# Altium schematic sheet PAGE6 - BANK2 I_0.SchDoc
size 386 x 246 mm
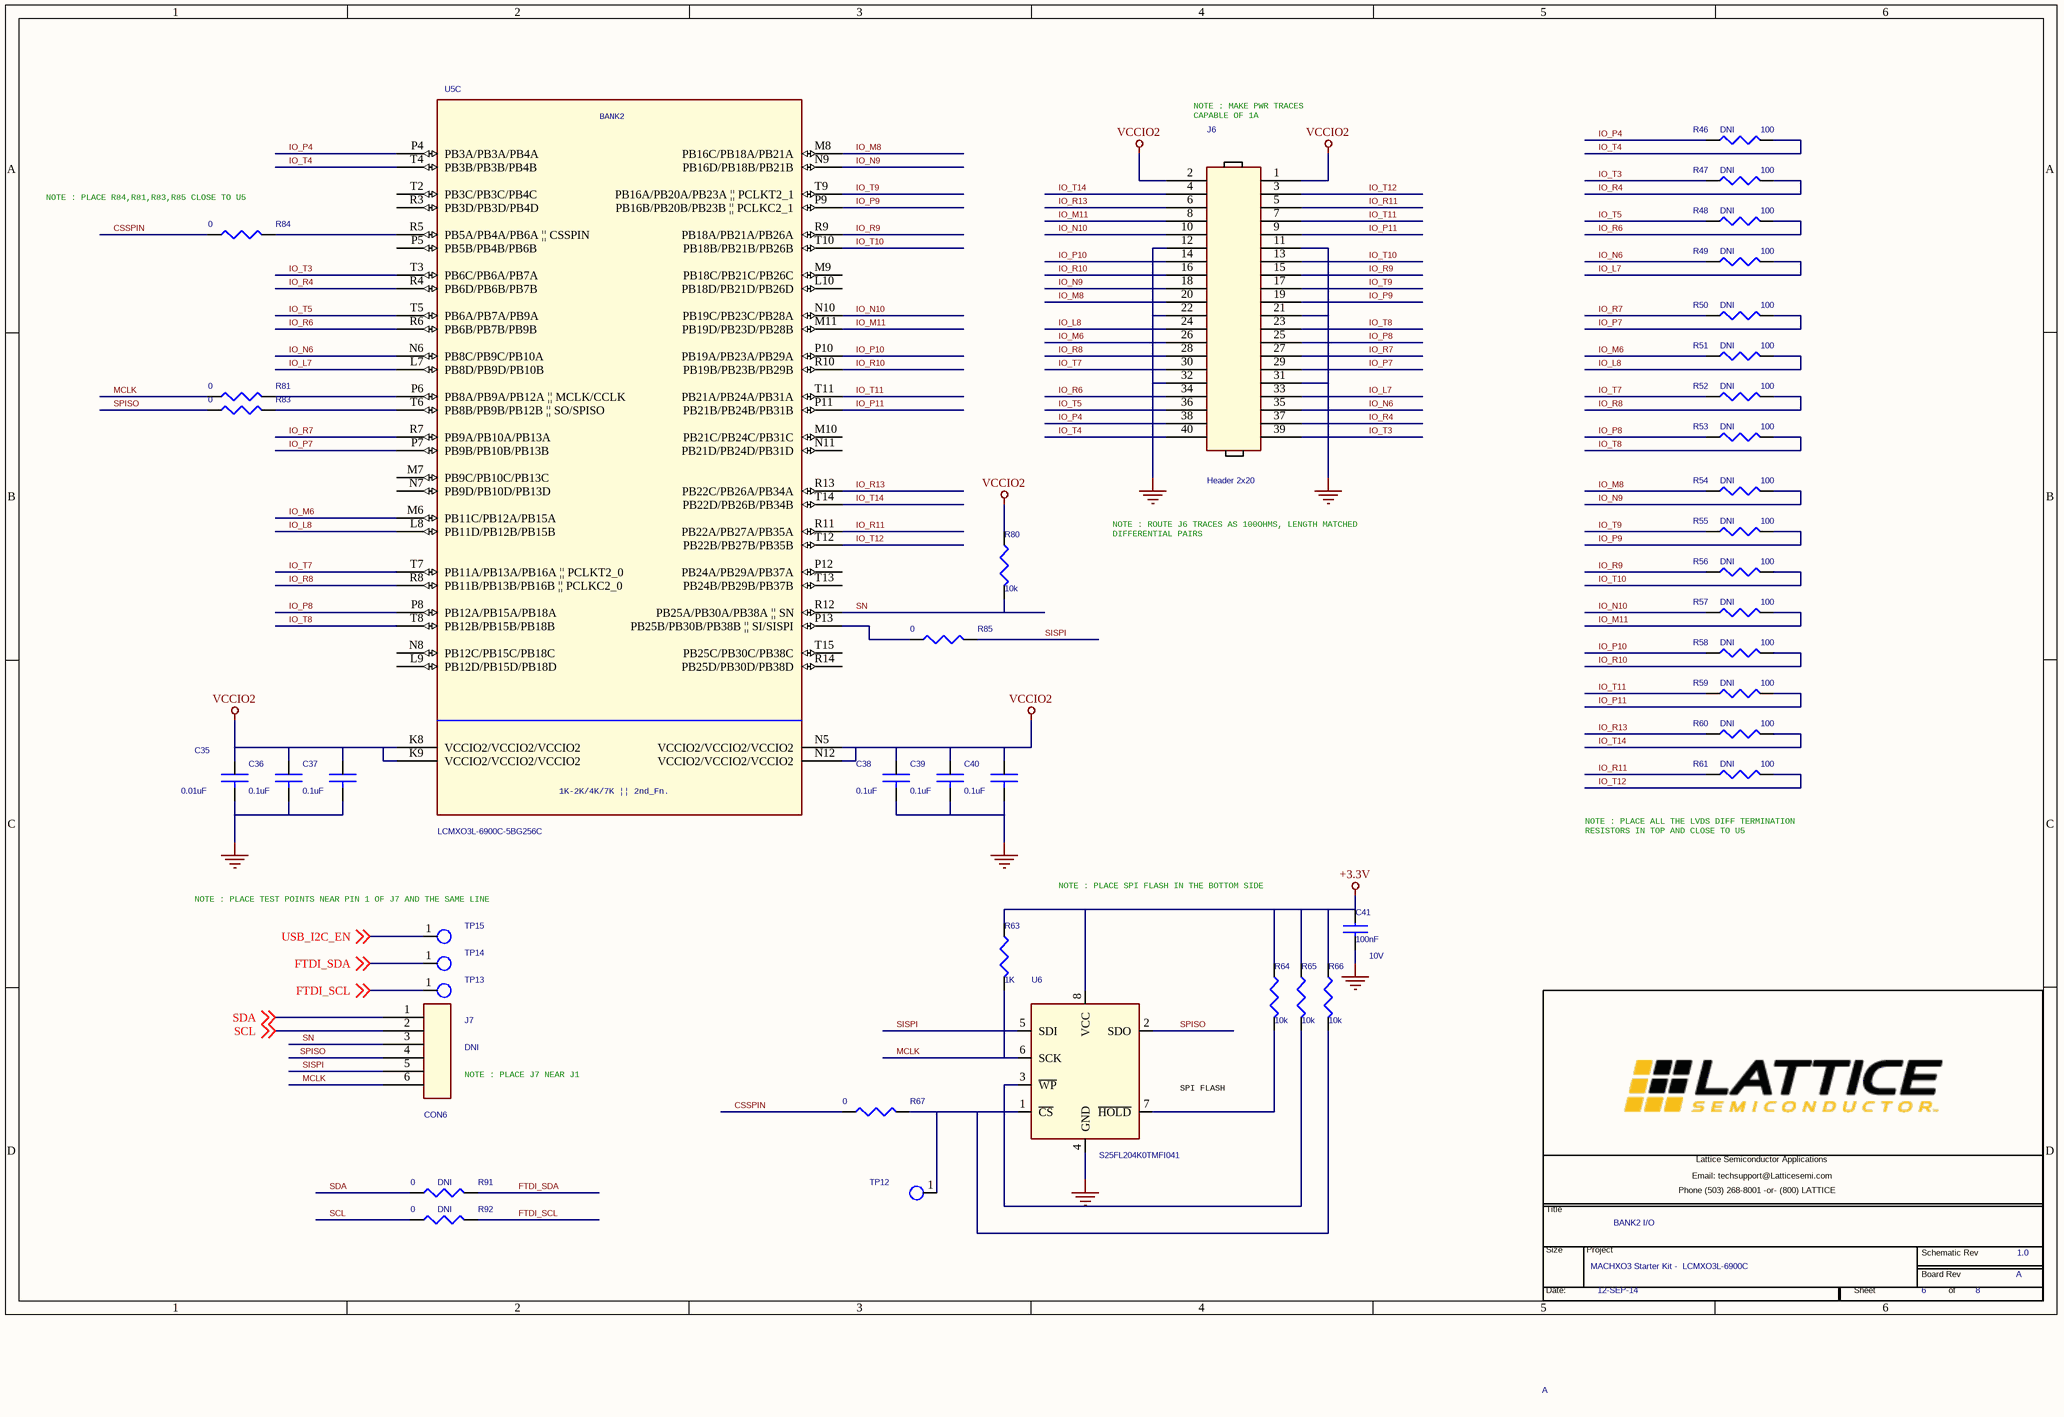
[diagram p0: PAGE6 - BANK2 I_0.SchDoc]

## Parts
*  Project Name: MACHXO3 Starter Kit -  LCMXO3L-6900C  Title: BANK2 I/O  Page Number: 6  Page Count: 8  RevCode: 1.0  Page Size: A  Date:: 12-SEP-14  (hidden comment: Lattice Title Block New Brand)  (graphical)
C35  0.01uF  [cc0402]
C36  0.1uF  [cc0402]
C37  0.1uF  [cc0402]
C38  0.1uF  [cc0402]
C39  0.1uF  [cc0402]
C40  0.1uF  [cc0402]
C41  100nF  Voltage: 10V  [C0402]
J6  Header 2x20  [hdr_samtec_mtsw_2x20_100]
J7  CON6  Assy: DNI  [hdr_samtec_tsw_1x6_100]
R46  100  Assy: DNI  [cr0603]
R47  100  Assy: DNI  [cr0603]
R48  100  Assy: DNI  [cr0603]
R49  100  Assy: DNI  [cr0603]
R50  100  Assy: DNI  [cr0603]
R51  100  Assy: DNI  [cr0603]
R52  100  Assy: DNI  [cr0603]
R53  100  Assy: DNI  [cr0603]
R54  100  Assy: DNI  [cr0603]
R55  100  Assy: DNI  [cr0603]
R56  100  Assy: DNI  [cr0603]
R57  100  Assy: DNI  [cr0603]
R58  100  Assy: DNI  [cr0603]
R59  100  Assy: DNI  [cr0603]
R60  100  Assy: DNI  [cr0603]
R61  100  Assy: DNI  [cr0603]
R63  1K  [R0402]
R64  10k  [R0402]
R65  10k  [R0402]
R66  10k  [R0402]
R67  0  [cr0603]
R80  10k  [R0402]
R81  0  [cr0603]
R83  0  [cr0603]
R84  0  [cr0603]
R85  0  [cr0603]
R91  0  Assy: DNI  [cr0603]
R92  0  Assy: DNI  [cr0603]
TP12  tp_s_40_63  [tp_s_40_63]  (value not drawn)
TP13  tp_s_40_63  [tp_s_40_63]  (value not drawn)
TP14  tp_s_40_63  [tp_s_40_63]  (value not drawn)
TP15  tp_s_40_63  [tp_s_40_63]  (value not drawn)
U5  LCMXO3L-6900C-5BG256C  [bga256_0p8_14p0]  (part C of 7)
U6  S25FL204K0TMFI041  [so8_50_244]

## Nets
+3.3V: C41.1 R63.1 R64.1 R65.1 R66.1 U6.8(VCC)
GND: C35.2 C36.2 C37.2 C38.2 C39.2 C40.2 C41.2 J6.11 J6.12 J6.21 J6.22 J6.31 J6.32 U6.4(GND)
VCCIO2: C35.1 C36.1 C37.1 C38.1 C39.1 C40.1 J6.1 J6.2 R80.1 U5.K8(VCCIO2/VCCIO2/VCCIO2) U5.K9(VCCIO2/VCCIO2/VCCIO2) U5.N5(VCCIO2/VCCIO2/VCCIO2) U5.N12(VCCIO2/VCCIO2/VCCIO2)
CSSPIN: R67.1 R84.1
FTDI_SCL: R92.2 TP13.1(TP) ; off-sheet FTDI_SCL
FTDI_SDA: R91.2 TP14.1(TP) ; off-sheet FTDI_SDA
IO_L7: J6.33 R49.2 U5.L7(PB8D/PB9D/PB10B)
IO_L8: J6.24 R51.2 U5.L8(PB11D/PB12B/PB15B)
IO_M6: J6.26 R51.1 U5.M6(PB11C/PB12A/PB15A)
IO_M8: J6.20 R54.1 U5.M8(PB16C/PB18A/PB21A)
IO_M11: J6.8 R57.2 U5.M11(PB19D/PB23D/PB28B)
IO_N6: J6.35 R49.1 U5.N6(PB8C/PB9C/PB10A)
IO_N9: J6.18 R54.2 U5.N9(PB16D/PB18B/PB21B)
IO_N10: J6.10 R57.1 U5.N10(PB19C/PB23C/PB28A)
IO_P4: J6.38 R46.1 U5.P4(PB3A/PB3A/PB4A)
IO_P7: J6.29 R50.2 U5.P7(PB9B/PB10B/PB13B)
IO_P8: J6.25 R53.1 U5.P8(PB12A/PB15A/PB18A)
IO_P9: J6.19 R55.2 U5.P9(PB16B/PB20B/PB23B_||_PCLKC2_1)
IO_P10: J6.14 R58.1 U5.P10(PB19A/PB23A/PB29A)
IO_P11: J6.9 R59.2 U5.P11(PB21B/PB24B/PB31B)
IO_R4: J6.37 R47.2 U5.R4(PB6D/PB6B/PB7B)
IO_R6: J6.34 R48.2 U5.R6(PB6B/PB7B/PB9B)
IO_R7: J6.27 R50.1 U5.R7(PB9A/PB10A/PB13A)
IO_R8: J6.28 R52.2 U5.R8(PB11B/PB13B/PB16B_||_PCLKC2_0)
IO_R9: J6.15 R56.1 U5.R9(PB18A/PB21A/PB26A)
IO_R10: J6.16 R58.2 U5.R10(PB19B/PB23B/PB29B)
IO_R11: J6.5 R61.1 U5.R11(PB22A/PB27A/PB35A)
IO_R13: J6.6 R60.1 U5.R13(PB22C/PB26A/PB34A)
IO_T3: J6.39 R47.1 U5.T3(PB6C/PB6A/PB7A)
IO_T4: J6.40 R46.2 U5.T4(PB3B/PB3B/PB4B)
IO_T5: J6.36 R48.1 U5.T5(PB6A/PB7A/PB9A)
IO_T7: J6.30 R52.1 U5.T7(PB11A/PB13A/PB16A_||_PCLKT2_0)
IO_T8: J6.23 R53.2 U5.T8(PB12B/PB15B/PB18B)
IO_T9: J6.17 R55.1 U5.T9(PB16A/PB20A/PB23A_||_PCLKT2_1)
IO_T10: J6.13 R56.2 U5.T10(PB18B/PB21B/PB26B)
IO_T11: J6.7 R59.1 U5.T11(PB21A/PB24A/PB31A)
IO_T12: J6.3 R61.2 U5.T12(PB22B/PB27B/PB35B)
IO_T14: J6.4 R60.2 U5.T14(PB22D/PB26B/PB34B)
MCLK: J7.6 R63.2 R81.1 U6.6(SCK)
SCL: J7.2 R92.1 ; off-sheet SCL
SDA: J7.1 R91.1 ; off-sheet SDA
SISPI: J7.5 R85.2 U6.5(SDI)
SN: J7.3 R80.2 U5.R12(PB25A/PB30A/PB38A_||_SN)
SPISO: J7.4 R83.1 U6.2(SDO)
USB_I2C_EN: TP15.1(TP) ; off-sheet USB_I2C_EN
NetR64_2: R64.2 U6.7(~{HOLD})
NetR65_2: R65.2 U6.3(~{WP})
NetR66_2: R66.2 R67.2 TP12.1(TP) U6.1(~{CS})
NetR81_2: R81.2 U5.P6(PB8A/PB9A/PB12A_||_MCLK/CCLK)
NetR83_2: R83.2 U5.T6(PB8B/PB9B/PB12B_||_SO/SPISO)
NetR84_2: R84.2 U5.R5(PB5A/PB4A/PB6A_||_CSSPIN)
NetR85_1: R85.1 U5.P13(PB25B/PB30B/PB38B_||_SI/SISPI)

Not connected (* = marked no-connect by the designer): U5 L9(PB12D/PB15D/PB18D) L10(PB18D/PB21D/PB26D) M7(PB9C/PB10C/PB13C) M9(PB18C/PB21C/PB26C) M10(PB21C/PB24C/PB31C) N7(PB9D/PB10D/PB13D) N8(PB12C/PB15C/PB18C) N11(PB21D/PB24D/PB31D) P5(PB5B/PB4B/PB6B) P12(PB24A/PB29A/PB37A) R3(PB3D/PB3D/PB4D) R14(PB25D/PB30D/PB38D) T2(PB3C/PB3C/PB4C) T13(PB24B/PB29B/PB37B) T15(PB25C/PB30C/PB38C)

## Notes on the sheet
- NOTE : MAKE PWR TRACES
  CAPABLE OF 1A
- (near R84) NOTE : PLACE R84,R81,R83,R85 CLOSE TO U5
- NOTE : ROUTE J6 TRACES AS 100OHMS, LENGTH MATCHED
  DIFFERENTIAL PAIRS
- (near R61) NOTE : PLACE ALL THE LVDS DIFF TERMINATION
  RESISTORS IN TOP AND CLOSE TO U5
- (near TP15) NOTE : PLACE TEST POINTS NEAR PIN 1 OF J7 AND THE SAME LINE
- NOTE : PLACE SPI FLASH IN THE BOTTOM SIDE
- (near J7) NOTE : PLACE J7 NEAR J1
- (near U6) SPI FLASH
- (in symbol Lattice Title Block New Brand) Lattice Semiconductor Applications; Email: techsupport@Latticesemi.com; Phone (503) 268-8001 -or- (800) LATTICE; Title; Size; Project; Schematic Rev; Board Rev; Date:; Sheet; of
- (in symbol LCMXO3L-1K/2K/4K/7K-BG256, part C) BANK2; 1K-2K/4K/7K || 2nd_Fn.

## Library data of the parts
C35 = 0_01uF_0402: CAP CER 10000PF 16V 5% X7R 0402; Manufacturer Part Number: C0402C103J4RACTU; Manufacturer: Kemet; Class: Discrete; Digikey P/N: 399-1039-1-ND
C36-C40 = 0u1_0402: CAP CER 0.1UF 16V 10% X7R 0402; Manufacturer Part Number: C0402C104K4RACTU; Manufacturer: Kemet; Class: Discrete; Digikey P/N: 399-3521-2-ND
C41 = CAP_CER_100nF_0402_10V: CAP CER 0.1UF 10V 10% X5R 0402; Unit Price (USD): 0.1; MFG: Murata; MFG P/N: GRM155R61A104KA01D; Total Area(sq-mm): 0.5; Length(mm): 1; Digikey P/N: 490-1318-2-ND; Manufacturer Part Number: GRM155R61A104KA01D; Manufacturer: Murata
J6 = HEADER 20X2: CONN HEADER 40POS .100" DL GOLD; Manufacturer Part Number: TSW-120-07-G-D; Manufacturer: Samtec; ASSY: DNI; Digikey P/N: SAM1028-20-ND
J7 = CON6: CONN HEADER 6POS .100" SNGL; Manufacturer Part Number: TSW-106-07-F-S-ND; Manufacturer: Samtec; Digikey P/N: TSW-106-07-F-S-ND
R46-R61 = 100R_0603: RES 100 OHM 1/16W 1% 0402 SMD; Manufacturer: Yageo; Manufacturer Part Number: RC0402FR07100RL; Class: Discrete; Digikey P/N: 311-100LRCT-ND
R63 = RES_10K_1W16_0402_5P: RES 1K OHM 1/10W 1% 0603 SMD; Manufacturer: Yageo; TC2: 0; MFG: Stackpole Electronics Inc; MFG P/N: RC0603FR-071KL; MAX_TEMP: RTMAX; DIST: FLAT; Wattage: 1/16W; Total Area(sq-mm): 0.5; Unit Price (USD): 0.02; TC1: 0; Width(mm): 0.5; Length(mm): 1; Digikey P/N: 311-1.00KHRCT-ND; Manufacturer Part Number: RC0603FR-071KL
R64-R66 R80 = RES_10K_1W16_0402_5P: RES 10K OHM 1/10W 5% 0603; Manufacturer Part Number: RMCF0603JT10K0; TC2: 0; MFG: Stackpole Electronics Inc; MFG P/N: RMCF0402JT10K0; MAX_TEMP: RTMAX; DIST: FLAT; Total Area(sq-mm): 0.5; Unit Price (USD): 0.02; TC1: 0; Wattage: 1/10W; Width(mm): 0.5; Length(mm): 1; Manufacturer: Stackpole Electronics Inc; Digikey P/N: RMCF0603JT10K0TR-ND
R67 R81 R83-R85 R91 R92 = 0R_0603: RES 0.0 OHM 1/10W JUMP 0603 SMD; Manufacturer Part Number: RC0603JR-070RL; Manufacturer: Yageo; Class: Discrete; Digikey P/N: 311-0.0GRTR-ND
TP12-TP15 = TP_S_40_63: Square test point, 40mil inner diameter, 63mil outer diameter; Assy: DNI; Class: IO
U5 = LCMXO3L-1K/2K/4K/7K-BG256: IC FPGA 6864LUTS 256BGA; Manufacturer: Lattice semi; Source Part: LCMXO3L-1K/2K/4K/7K-BG256A.Normal; SPLIT_INST: TRUE; SWAP_INFO: (S1+S2+S3+S4+S5+S6+S7); Name: I16790692; Primitive: DEFAULT; Implementation Type: <none>; Location X-Coordinate: 0; Source Library: D:\DESIGN_DOC\XO3\LATTICEORCADCAPTURESCHEMATICLIBRARYOLB\LATTICEORCADCAPTURESCHEMATICLIBRARYOLB\LATTICE_SYM\LATTICEPLDS.OLB; Power Pins Visible: False; Location Y-Coordinate: 0; Color: Default; Source Package: LCMXO3L-1K/2K/4K/7K-BG256; Graphic: LCMXO3L-1K/2K/4K/7K-BG256A.Normal; Manufacturer Part Number: LCMXO3L-6900C-5BG256C; Digikey P/N: 220-1886-ND
U6 = SPI_FLASH_32Mb_SOIC8: IC FLASH 4MBIT 85MHZ 8SO; Manufacturer: Spansion; Unit Price (USD): 1.1275; Total Area(sq-mm): 20; MFG: Micron; Cost Ea/1k: 0.74321; MFG P/N: N25Q032A13ESC40F; Length(mm): 5; Width(mm): 4; Digikey P/N: 1274-1088-ND; Manufacturer Part Number: S25FL204K0TMFI041
* = Lattice Title Block New Brand: Board Rev: A